# Altium schematic sheet PAGE05 FPGA Config.SchDoc
size 420 x 297 mm
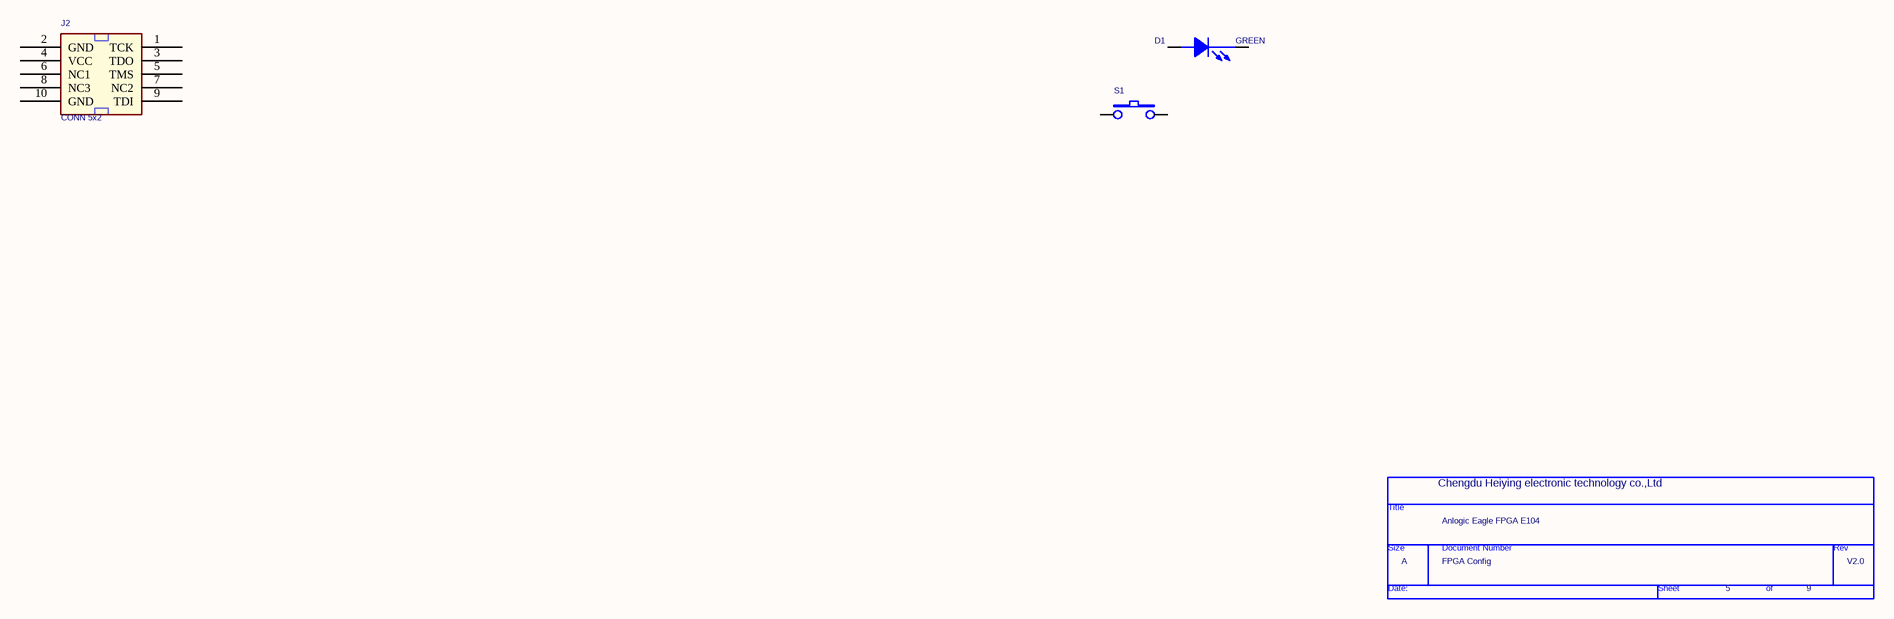
[diagram p0: PAGE05 FPGA Config.SchDoc]

## Parts
*  Page Count: 9  Page Number: 5  Page Size: A  Title: Anlogic Eagle FPGA E104  RevCode: V2.0  Doc: FPGA Config  (hidden comment: TitleBlock0)  (graphical)
D1  GREEN  [Q0603]
J2  CONN 5x2  [DIP10-2P54-I]
S1  FSMRA2JH  [SMD_3X4X2MM]  (value not drawn)

## Nets

Not connected (* = marked no-connect by the designer): D1 1(ANODE) 2(CATHODE); J2 1(TCK) 2(GND) 3(TDO) 4(VCC) 5(TMS) 6(NC1) 7(NC2) 8(NC3) 9(TDI) 10(GND); S1 1 2

## Notes on the sheet
- (near *) Chengdu Heiying electronic technology co.,Ltd
- (in symbol TitleBlock0) Title; Size; Document Number; Rev; Date:; Sheet; of

## Library data of the parts
D1 = LED: ROOM: POWER
J2 = CONN RCPT 5x2/SM_0
S1 = SWITCH_2: SWITCH TACT RA H=3.86MM 160GF; MANUFACTURER: TYCO; ROOM: CPU; MANUFACTURER P/N: FSMRA2JH
* = TitleBlock0: Page Create Date: March  8, 1995